# EAGLE design CircuitClockAutorouted (EAGLE 9.4.2)
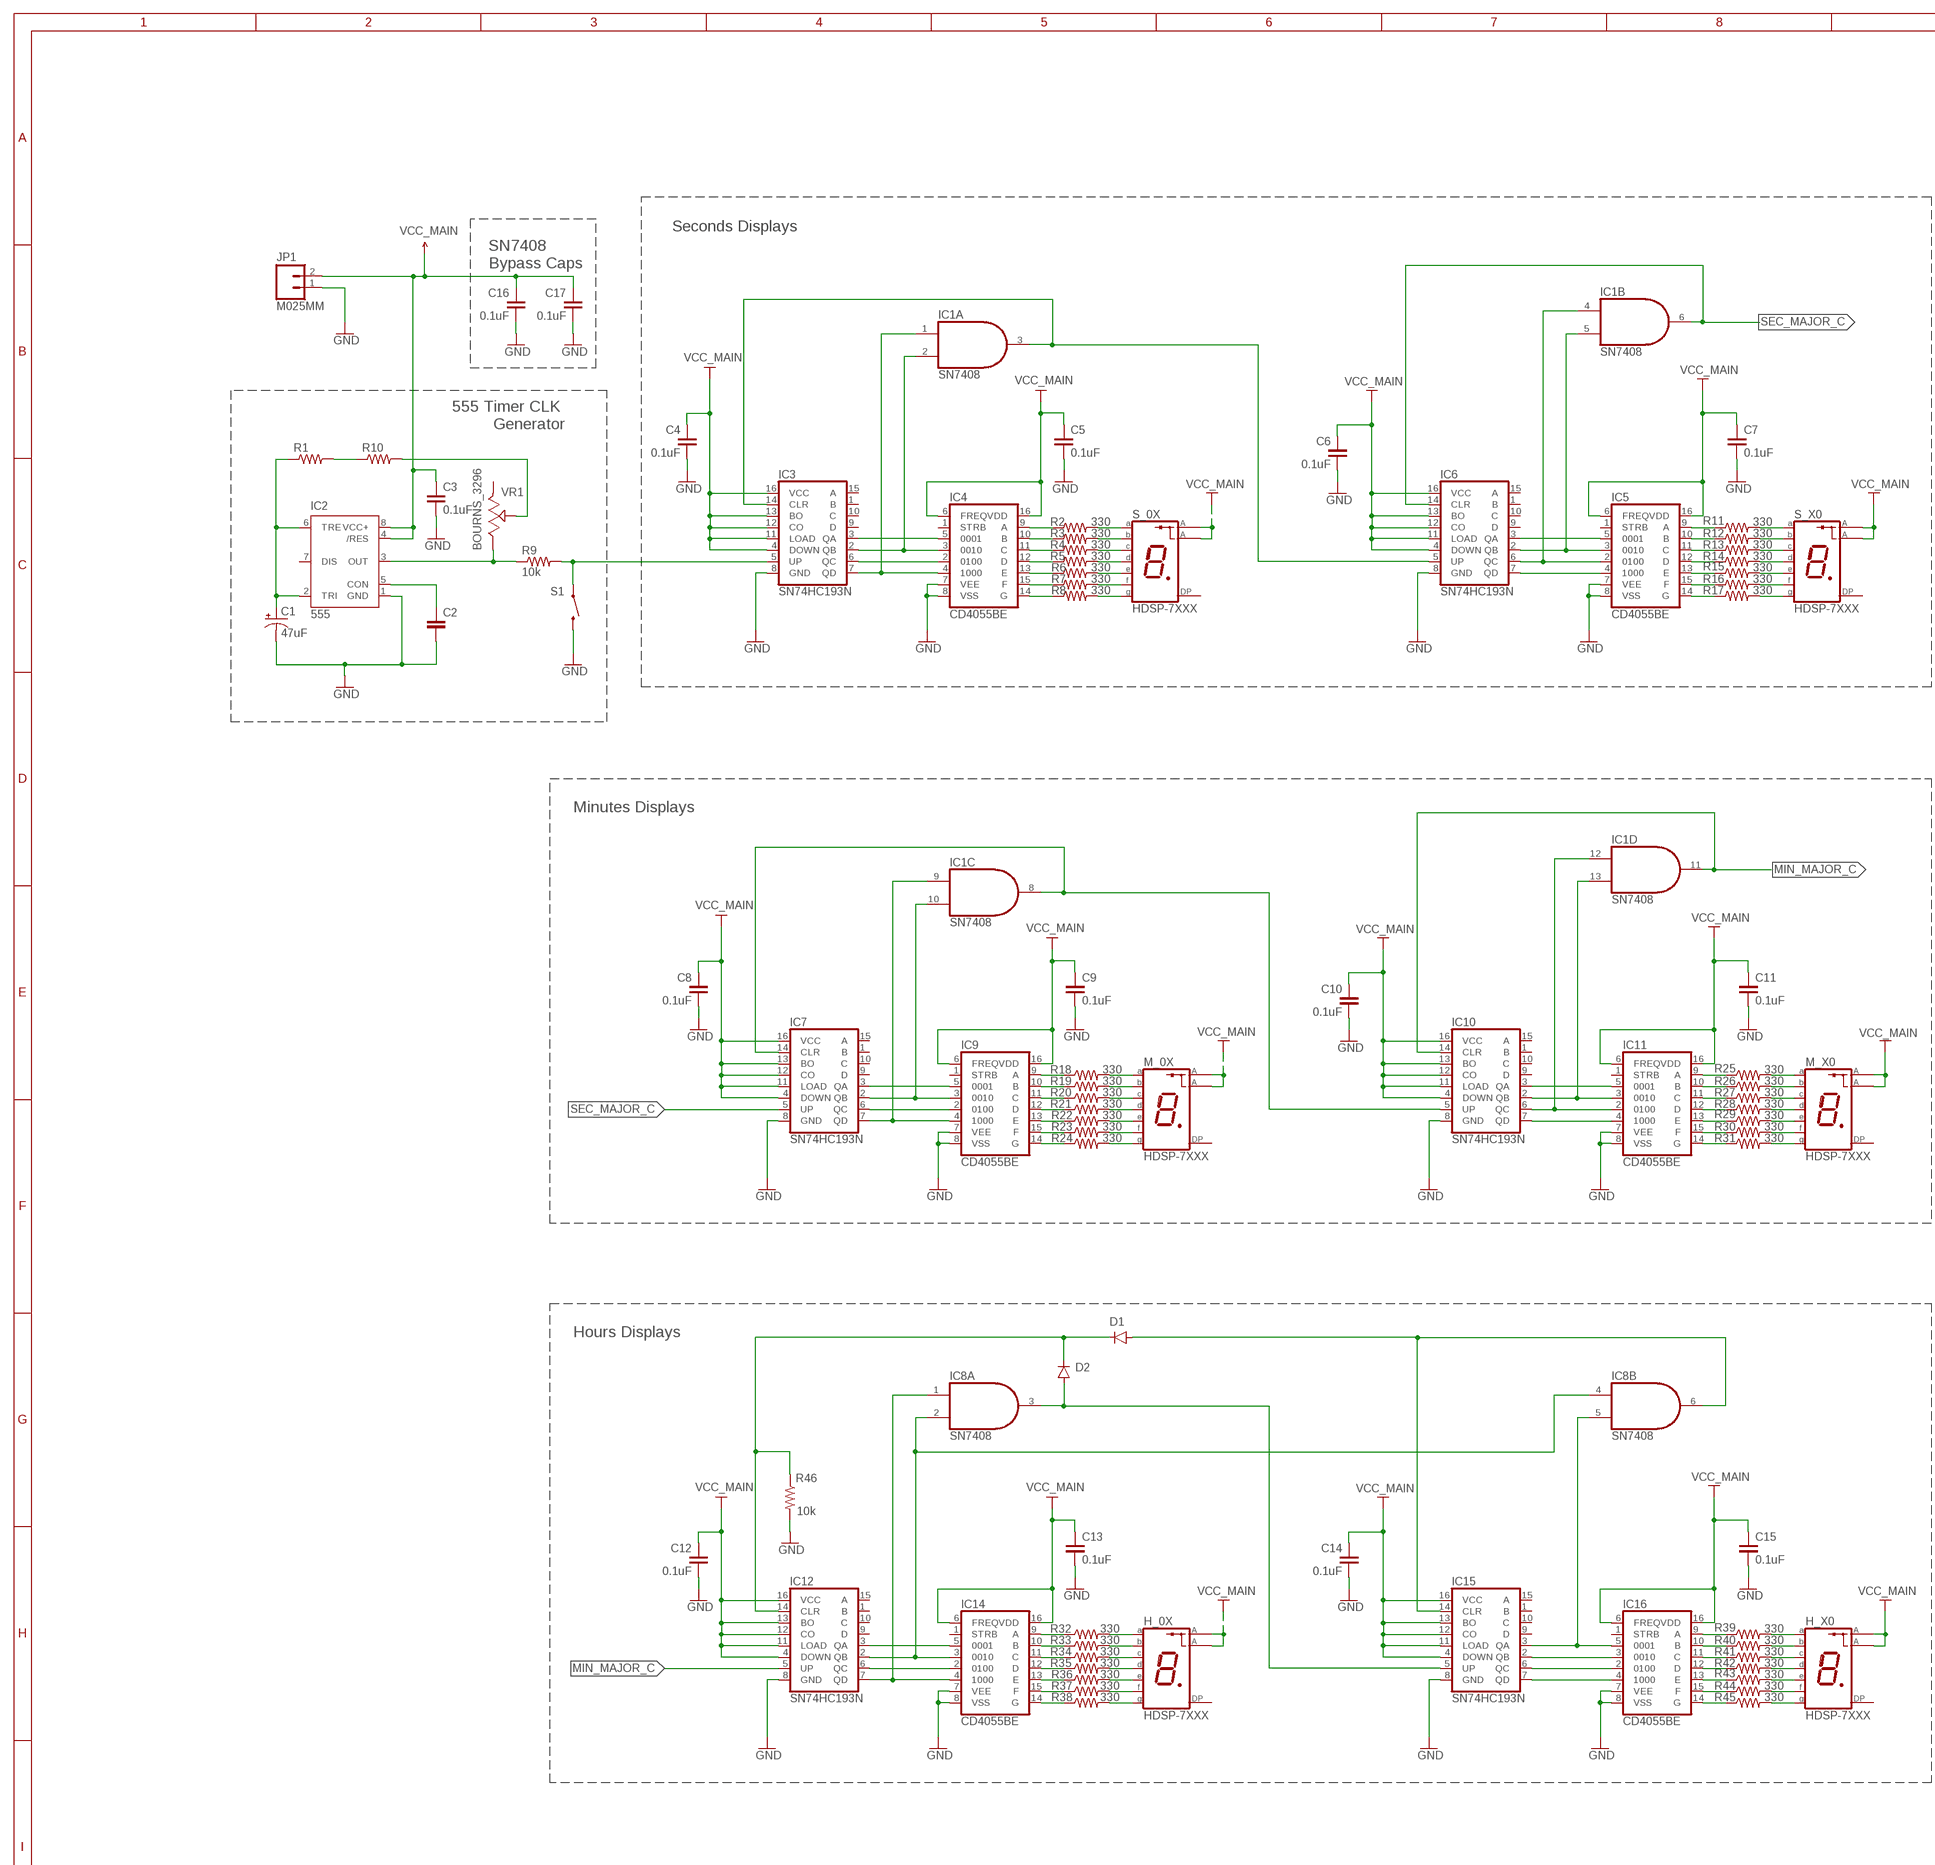
[diagram p0: schematic, sheet 1, part 1 of 2]
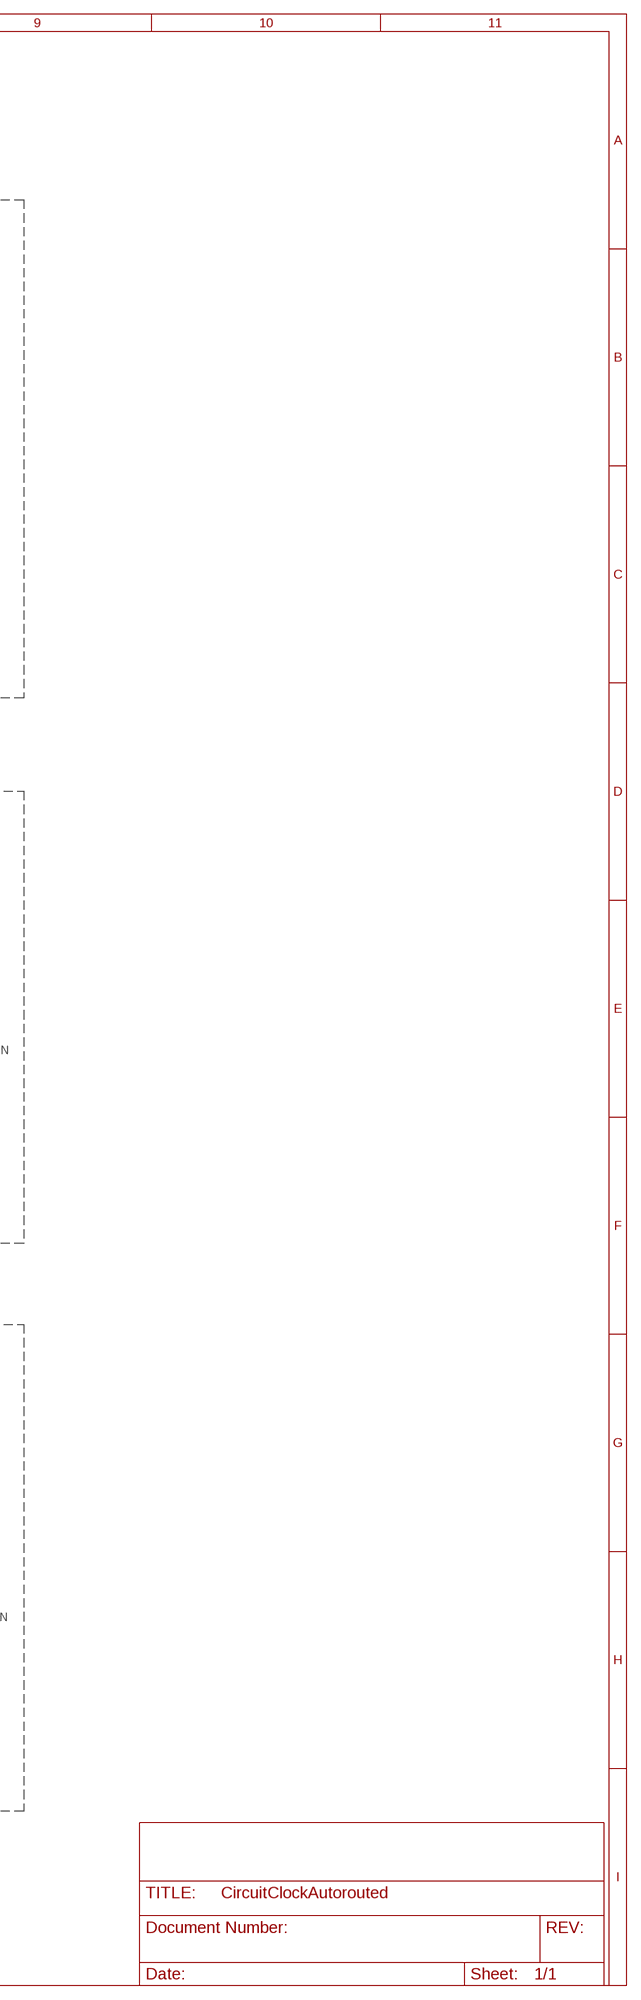
[diagram p1: schematic, sheet 1, part 2 of 2]

## Parts
C1  47uF  RADIAL_POL2.54MM_LEAD-6.3MM_DIA  [2.54MM_LEAD-6.3MM_DIA]
C2  CAPPTH  [CAP-PTH-SMALL]
C3  0.1uF  NON_POL_2.5MM  [2.54MM_LEAD]
C4  0.1uF  NON_POL_2.5MM  [2.54MM_LEAD]
C5  0.1uF  NON_POL_2.5MM  [2.54MM_LEAD]
C6  0.1uF  NON_POL_2.5MM  [2.54MM_LEAD]
C7  0.1uF  NON_POL_2.5MM  [2.54MM_LEAD]
C8  0.1uF  NON_POL_2.5MM  [2.54MM_LEAD]
C9  0.1uF  NON_POL_2.5MM  [2.54MM_LEAD]
C10  0.1uF  NON_POL_2.5MM  [2.54MM_LEAD]
C11  0.1uF  NON_POL_2.5MM  [2.54MM_LEAD]
C12  0.1uF  NON_POL_2.5MM  [2.54MM_LEAD]
C13  0.1uF  NON_POL_2.5MM  [2.54MM_LEAD]
C14  0.1uF  NON_POL_2.5MM  [2.54MM_LEAD]
C15  0.1uF  NON_POL_2.5MM  [2.54MM_LEAD]
C16  0.1uF  NON_POL_2.5MM  [2.54MM_LEAD]
C17  0.1uF  NON_POL_2.5MM  [2.54MM_LEAD]
D1  THROUGH_HOLE_DO-35  [DO35-10]
D2  THROUGH_HOLE_DO-35  [DO35-10]
H_0X  HDSP-7XXX  [HDSP-7XXX]
H_X0  HDSP-7XXX  [HDSP-7XXX]
IC1  SN7408  74S08N  [DIL14]
IC2  555  555KIT  [DIP08-KIT]
IC3  SN74HC193N  [DIL16]
IC4  CD4055BE  [DIL16]
IC5  CD4055BE  [DIL16]
IC6  SN74HC193N  [DIL16]
IC7  SN74HC193N  [DIL16]
IC8  SN7408  74S08N  [DIL14]
IC9  CD4055BE  [DIL16]
IC10  SN74HC193N  [DIL16]
IC11  CD4055BE  [DIL16]
IC12  SN74HC193N  [DIL16]
IC14  CD4055BE  [DIL16]
IC15  SN74HC193N  [DIL16]
IC16  CD4055BE  [DIL16]
JP1  M025MM  [SCREWTERMINAL-5MM-2]
M_0X  HDSP-7XXX  [HDSP-7XXX]
M_X0  HDSP-7XXX  [HDSP-7XXX]
R1  RESISTORAXIAL-0.3  [AXIAL-0.3]
R2  330  THROUGH_HOLE_1/4W_0.3  [1/4W_0.3]
R3  330  THROUGH_HOLE_1/4W_0.3  [1/4W_0.3]
R4  330  THROUGH_HOLE_1/4W_0.3  [1/4W_0.3]
R5  330  THROUGH_HOLE_1/4W_0.3  [1/4W_0.3]
R6  330  THROUGH_HOLE_1/4W_0.3  [1/4W_0.3]
R7  330  THROUGH_HOLE_1/4W_0.3  [1/4W_0.3]
R8  330  THROUGH_HOLE_1/4W_0.3  [1/4W_0.3]
R9  10k  RESISTORAXIAL-0.3  [AXIAL-0.3]
R10  RESISTORAXIAL-0.3  [AXIAL-0.3]
R11  330  THROUGH_HOLE_1/4W_0.3  [1/4W_0.3]
R12  330  THROUGH_HOLE_1/4W_0.3  [1/4W_0.3]
R13  330  THROUGH_HOLE_1/4W_0.3  [1/4W_0.3]
R14  330  THROUGH_HOLE_1/4W_0.3  [1/4W_0.3]
R15  330  THROUGH_HOLE_1/4W_0.3  [1/4W_0.3]
R16  330  THROUGH_HOLE_1/4W_0.3  [1/4W_0.3]
R17  330  THROUGH_HOLE_1/4W_0.3  [1/4W_0.3]
R18  330  THROUGH_HOLE_1/4W_0.3  [1/4W_0.3]
R19  330  THROUGH_HOLE_1/4W_0.3  [1/4W_0.3]
R20  330  THROUGH_HOLE_1/4W_0.3  [1/4W_0.3]
R21  330  THROUGH_HOLE_1/4W_0.3  [1/4W_0.3]
R22  330  THROUGH_HOLE_1/4W_0.3  [1/4W_0.3]
R23  330  THROUGH_HOLE_1/4W_0.3  [1/4W_0.3]
R24  330  THROUGH_HOLE_1/4W_0.3  [1/4W_0.3]
R25  330  THROUGH_HOLE_1/4W_0.3  [1/4W_0.3]
R26  330  THROUGH_HOLE_1/4W_0.3  [1/4W_0.3]
R27  330  THROUGH_HOLE_1/4W_0.3  [1/4W_0.3]
R28  330  THROUGH_HOLE_1/4W_0.3  [1/4W_0.3]
R29  330  THROUGH_HOLE_1/4W_0.3  [1/4W_0.3]
R30  330  THROUGH_HOLE_1/4W_0.3  [1/4W_0.3]
R31  330  THROUGH_HOLE_1/4W_0.3  [1/4W_0.3]
R32  330  THROUGH_HOLE_1/4W_0.3  [1/4W_0.3]
R33  330  THROUGH_HOLE_1/4W_0.3  [1/4W_0.3]
R34  330  THROUGH_HOLE_1/4W_0.3  [1/4W_0.3]
R35  330  THROUGH_HOLE_1/4W_0.3  [1/4W_0.3]
R36  330  THROUGH_HOLE_1/4W_0.3  [1/4W_0.3]
R37  330  THROUGH_HOLE_1/4W_0.3  [1/4W_0.3]
R38  330  THROUGH_HOLE_1/4W_0.3  [1/4W_0.3]
R39  330  THROUGH_HOLE_1/4W_0.3  [1/4W_0.3]
R40  330  THROUGH_HOLE_1/4W_0.3  [1/4W_0.3]
R41  330  THROUGH_HOLE_1/4W_0.3  [1/4W_0.3]
R42  330  THROUGH_HOLE_1/4W_0.3  [1/4W_0.3]
R43  330  THROUGH_HOLE_1/4W_0.3  [1/4W_0.3]
R44  330  THROUGH_HOLE_1/4W_0.3  [1/4W_0.3]
R45  330  THROUGH_HOLE_1/4W_0.3  [1/4W_0.3]
R46  10k  THROUGH_HOLE_1/4W_0.3  [1/4W_0.3]
S1  SWITCH-MOMENTARY-2PTH  [TACTILE-PTH]
S_0X  HDSP-7XXX  [HDSP-7XXX]
S_X0  HDSP-7XXX  [HDSP-7XXX]
VR1  BOURNS_3296  [3296]

## Nets
CLK: IC3.5(UP) R9.P$2 S1.1
GND: C1.- C2.2 C3.2 C4.2 C5.2 C6.2 C7.2 C8.2 C9.2 C10.2 C11.2 C12.2 C13.2 C14.2 C15.2 C16.2 C17.2 IC2.1(GND) IC3.8(GND) IC4.7(VEE) IC4.8(VSS) IC5.7(VEE) IC5.8(VSS) IC6.8(GND) IC7.8(GND) IC9.7(VEE) IC9.8(VSS) IC10.8(GND) IC11.7(VEE) IC11.8(VSS) IC12.8(GND) IC14.7(VEE) IC14.8(VSS) IC15.8(GND) IC16.7(VEE) IC16.8(VSS) JP1.1 R46.P$2 S1.3
HR_MAJOR_C: D1.C D2.C IC12.14(CLR) R46.P$1
HR_MINOR_C: D2.A IC8.3(A:O) IC15.5(UP)
MIN_MAJOR_C: IC1.11(D:O) IC10.14(CLR) IC12.5(UP)
MIN_MINOR_C: IC1.8(C:O) IC7.14(CLR) IC10.5(UP)
N$1: IC1.4(B:I0) IC5.2 IC6.6(QC)
N$2: C1.+ IC2.2(TRI) IC2.6(TRE) R1.P$1
N$3: IC3.3(QA) IC4.5
N$4: C2.1 IC2.5(CON)
N$5: IC1.2(A:I1) IC3.2(QB) IC4.3
N$6: IC1.5(B:I1) IC5.3 IC6.2(QB)
N$7: IC7.3(QA) IC9.5
N$8 [Power]: IC4.9(A) R2.P$1
N$9 [Power]: IC4.10(B) R3.P$1
N$10 [Power]: IC4.11(C) R4.P$1
N$11 [Power]: IC4.12(D) R5.P$1
N$12 [Power]: IC4.13(E) R6.P$1
N$13 [Power]: IC4.15(F) R7.P$1
N$14 [Power]: IC4.14(G) R8.P$1
N$15: IC2.3(OUT) R9.P$1 VR1.1(A)
N$16 [Power]: R2.P$2 S_0X.P$10(A)
N$17 [Power]: R3.P$2 S_0X.P$9(B)
N$18 [Power]: R4.P$2 S_0X.P$8(C)
N$19 [Power]: R5.P$2 S_0X.P$5(D)
N$20 [Power]: R6.P$2 S_0X.P$4(E)
N$21 [Power]: R7.P$2 S_0X.P$2(F)
N$22 [Power]: R8.P$2 S_0X.P$3(G)
N$23: R1.P$2 R10.P$1
N$24: R10.P$2 VR1.2(S)
N$25: IC1.1(A:I0) IC3.7(QD) IC4.4
N$26 [Power]: IC9.9(A) R18.P$1
N$27: IC5.4 IC6.7(QD)
N$28: IC5.5 IC6.3(QA)
N$29: IC3.6(QC) IC4.2
N$30 [Power]: IC5.9(A) R11.P$1
N$31 [Power]: IC5.10(B) R12.P$1
N$32 [Power]: IC5.11(C) R13.P$1
N$33 [Power]: IC5.12(D) R14.P$1
N$34 [Power]: IC5.13(E) R15.P$1
N$35 [Power]: IC5.15(F) R16.P$1
N$36 [Power]: IC5.14(G) R17.P$1
N$37 [Power]: R11.P$2 S_X0.P$10(A)
N$38 [Power]: R12.P$2 S_X0.P$9(B)
N$39 [Power]: R13.P$2 S_X0.P$8(C)
N$40 [Power]: R14.P$2 S_X0.P$5(D)
N$41 [Power]: R15.P$2 S_X0.P$4(E)
N$42 [Power]: R16.P$2 S_X0.P$2(F)
N$43 [Power]: R17.P$2 S_X0.P$3(G)
N$44 [Power]: IC9.10(B) R19.P$1
N$45 [Power]: IC9.11(C) R20.P$1
N$46 [Power]: IC9.12(D) R21.P$1
N$47 [Power]: IC9.13(E) R22.P$1
N$48 [Power]: IC9.15(F) R23.P$1
N$49 [Power]: IC9.14(G) R24.P$1
N$50 [Power]: M_0X.P$10(A) R18.P$2
N$51 [Power]: M_0X.P$9(B) R19.P$2
N$52 [Power]: M_0X.P$8(C) R20.P$2
N$53 [Power]: M_0X.P$5(D) R21.P$2
N$54 [Power]: M_0X.P$4(E) R22.P$2
N$55 [Power]: M_0X.P$2(F) R23.P$2
N$56 [Power]: M_0X.P$3(G) R24.P$2
N$57: IC10.3(QA) IC11.5
N$58 [Power]: IC11.9(A) R25.P$1
N$59 [Power]: IC11.10(B) R26.P$1
N$60 [Power]: IC11.11(C) R27.P$1
N$61 [Power]: IC11.12(D) R28.P$1
N$62 [Power]: IC11.13(E) R29.P$1
N$63 [Power]: IC11.15(F) R30.P$1
N$64 [Power]: IC11.14(G) R31.P$1
N$65 [Power]: M_X0.P$10(A) R25.P$2
N$66 [Power]: M_X0.P$9(B) R26.P$2
N$67 [Power]: M_X0.P$8(C) R27.P$2
N$68 [Power]: M_X0.P$5(D) R28.P$2
N$69 [Power]: M_X0.P$4(E) R29.P$2
N$70 [Power]: M_X0.P$2(F) R30.P$2
N$71 [Power]: M_X0.P$3(G) R31.P$2
N$72: IC10.7(QD) IC11.4
N$73: IC7.6(QC) IC9.2
N$74: IC1.12(D:I0) IC10.6(QC) IC11.2
N$75: IC1.13(D:I1) IC10.2(QB) IC11.3
N$76: IC1.9(C:I0) IC7.7(QD) IC9.4
N$77: IC1.10(C:I1) IC7.2(QB) IC9.3
N$80: IC12.3(QA) IC14.5
N$81 [Power]: IC14.9(A) R32.P$1
N$82 [Power]: IC14.10(B) R33.P$1
N$83 [Power]: IC14.11(C) R34.P$1
N$84 [Power]: IC14.12(D) R35.P$1
N$85 [Power]: IC14.13(E) R36.P$1
N$86 [Power]: IC14.15(F) R37.P$1
N$87 [Power]: IC14.14(G) R38.P$1
N$88 [Power]: H_0X.P$10(A) R32.P$2
N$89 [Power]: H_0X.P$9(B) R33.P$2
N$90 [Power]: H_0X.P$8(C) R34.P$2
N$91 [Power]: H_0X.P$5(D) R35.P$2
N$92 [Power]: H_0X.P$4(E) R36.P$2
N$93 [Power]: H_0X.P$2(F) R37.P$2
N$94 [Power]: H_0X.P$3(G) R38.P$2
N$96 [Power]: IC16.9(A) R39.P$1
N$97 [Power]: IC16.10(B) R40.P$1
N$98 [Power]: IC16.11(C) R41.P$1
N$99 [Power]: IC16.12(D) R42.P$1
N$100 [Power]: IC16.13(E) R43.P$1
N$101 [Power]: IC16.15(F) R44.P$1
N$102 [Power]: IC16.14(G) R45.P$1
N$103 [Power]: H_X0.P$10(A) R39.P$2
N$104 [Power]: H_X0.P$9(B) R40.P$2
N$105 [Power]: H_X0.P$8(C) R41.P$2
N$106 [Power]: H_X0.P$5(D) R42.P$2
N$107 [Power]: H_X0.P$4(E) R43.P$2
N$108 [Power]: H_X0.P$2(F) R44.P$2
N$109 [Power]: H_X0.P$3(G) R45.P$2
N$110: IC15.7(QD) IC16.4
N$111: IC12.6(QC) IC14.2
N$112: IC15.6(QC) IC16.2
N$113: IC15.2(QB) IC16.3
N$114: IC8.1(A:I0) IC12.7(QD) IC14.4
N$115: IC8.2(A:I1) IC8.4(B:I0) IC12.2(QB) IC14.3
N$117: D1.A IC8.6(B:O) IC15.14(CLR)
N$118: IC8.5(B:I1) IC15.3(QA) IC16.5
SEC_MAJOR_C: IC1.6(B:O) IC6.14(CLR) IC7.5(UP)
SEC_MINOR_C: IC1.3(A:O) IC3.14(CLR) IC6.5(UP)
VCC_MAIN [Power]: C3.1 C4.1 C5.1 C6.1 C7.1 C8.1 C9.1 C10.1 C11.1 C12.1 C13.1 C14.1 C15.1 C16.1 C17.1 H_0X.P$1(A) H_0X.P$6(A) H_X0.P$1(A) H_X0.P$6(A) IC2.4(/RES) IC2.8(VCC+) IC3.4(DOWN) IC3.11(LOAD) IC3.12(CO) IC3.13(BO) IC3.16(VCC) IC4.6(FREQ) IC4.16(VDD) IC5.6(FREQ) IC5.16(VDD) IC6.4(DOWN) IC6.11(LOAD) IC6.12(CO) IC6.13(BO) IC6.16(VCC) IC7.4(DOWN) IC7.11(LOAD) IC7.12(CO) IC7.13(BO) IC7.16(VCC) IC9.6(FREQ) IC9.16(VDD) IC10.4(DOWN) IC10.11(LOAD) IC10.12(CO) IC10.13(BO) IC10.16(VCC) IC11.6(FREQ) IC11.16(VDD) IC12.4(DOWN) IC12.11(LOAD) IC12.12(CO) IC12.13(BO) IC12.16(VCC) IC14.6(FREQ) IC14.16(VDD) IC15.4(DOWN) IC15.11(LOAD) IC15.12(CO) IC15.13(BO) IC15.16(VCC) IC16.6(FREQ) IC16.16(VDD) JP1.2 M_0X.P$1(A) M_0X.P$6(A) M_X0.P$1(A) M_X0.P$6(A) S_0X.P$1(A) S_0X.P$6(A) S_X0.P$1(A) S_X0.P$6(A) ; supply symbol labelled SINK_UNDEFINED, SUPPLY_UNDEFINED
Unconnected: H_0X.P$7(DP) H_X0.P$7(DP) IC2.7(DIS) IC3.1(B) IC3.9(D) IC3.10(C) IC3.15(A) IC4.1(STRB) IC5.1(STRB) IC6.1(B) IC6.9(D) IC6.10(C) IC6.15(A) IC7.1(B) IC7.9(D) IC7.10(C) IC7.15(A) IC8.8(C:O) IC8.9(C:I0) IC8.10(C:I1) IC8.11(D:O) IC8.12(D:I0) IC8.13(D:I1) IC9.1(STRB) IC10.1(B) IC10.9(D) IC10.10(C) IC10.15(A) IC11.1(STRB) IC12.1(B) IC12.9(D) IC12.10(C) IC12.15(A) IC14.1(STRB) IC15.1(B) IC15.9(D) IC15.10(C) IC15.15(A) IC16.1(STRB) M_0X.P$7(DP) M_X0.P$7(DP) S_0X.P$7(DP) S_X0.P$7(DP) VR1.3(E)

## Notes on the sheet
- Seconds Displays
- SN7408
  Bypass Caps
- 555 Timer CLK 
  Generator
- Minutes Displays
- Hours Displays

## Power pins joined to a net without a drawn wire
GND: IC1.7(P:GND) IC8.7(P:GND)
VCC: IC1.14(P:VCC) IC8.14(P:VCC)

## Library data of the parts
C1 = Capacitors:RADIAL_POL
C2 = SparkFun-Capacitors:CAP: Capacitor Standard 0603 ceramic capacitor, and 0.1" leaded capacitor.
C3-C17 = Capacitors:NON_POL
D1 D2 = Diodes:THROUGH_HOLE: DIODE silicon-epitaxial planar diode
H_0X H_X0 M_0X M_X0 S_0X S_X0 = led-7-segment:HDSP-7XXX
IC1 IC8 = 74xx-us:74*08: Quad 2-input AND gate
IC2 = SparkFun-IC-Special-Function:555: General purpose bipolar Timer Datasheet <http://www.sparkfun.com/datasheets/Components/General/ne555.pdf> SparkFun Products SparkFun SparkPunk Sequencer Kit <https://www.sparkfun.com/products/12707> (KIT-12707) Storefront Component: 555 Timer <https://www.sparkfun.com/products/9273> (COM-09273) Two parts valid for production: VFP: IC-11930 (M7555 PTH) VFP: IC-09173 (555 PTH) - Preferred; PROD_ID: IC-09173; PROD_ID_ALT: IC-11930
IC3 IC6 IC7 IC10 IC12 IC15 = ICs:SN74HC193N
IC4 IC5 IC9 IC11 IC14 IC16 = ICs:CD4055BE
JP1 = SparkFun-Connectors:M02: Standard 2-pin 0.1" header. Use with - straight break away headers ( PRT-00116) - right angle break away headers (PRT-00553) - swiss pins (PRT-00743) - machine pins (PRT-00117) - female headers (PRT-00115) Molex polarized connector foot print use with: PRT-08233 with associated crimp pins and housings. 2.54_SCREWTERM for use with PRT-10571. 3.5mm Screw Terminal footprints for PRT-08084 5mm Screw Terminal footprints for use with PRT-08432; STOREFRONT_ID: PRT-08432
R1 R9 R10 = SparkFun-Passives:RESISTOR: Resistor Basic schematic elements and footprints for 0603, 1206, and PTH resistors.
R2-R8 R11-R46 = Resistors:THROUGH_HOLE
S1 = SparkFun-Electromechanical:SWITCH-MOMENTARY-2: Various NO switches- pushbuttons, reed, etc
VR1 = Offboard Potentiometer:BOURNS_3296

## Net classes
0 default: width 0.254 mm
1 Power: width 0.305 mm, clearance 0.305 mm to class 0

## Board
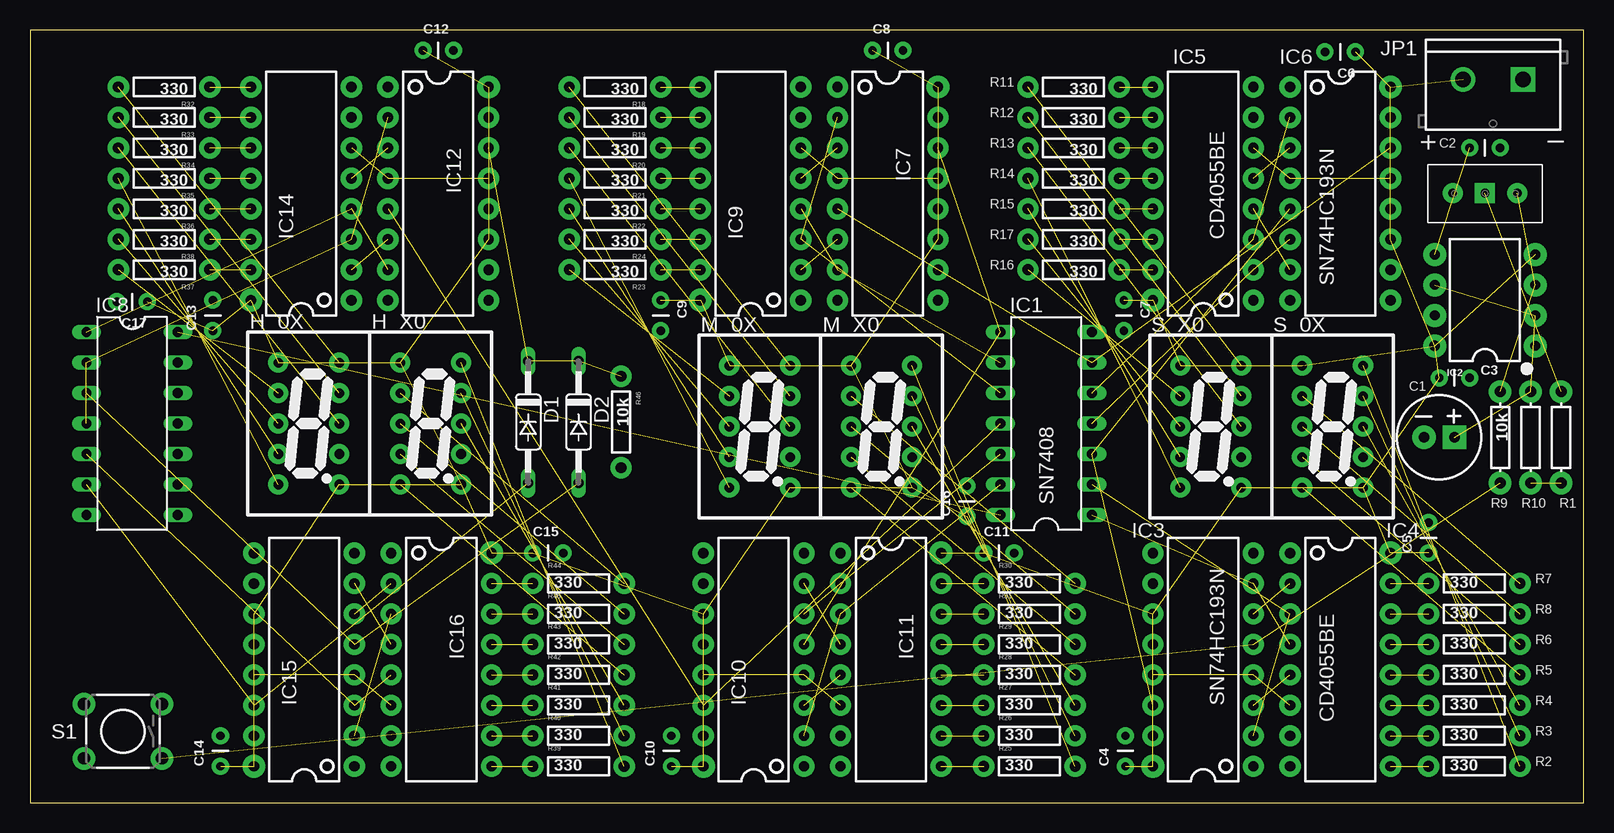
[diagram p2: board, top side]
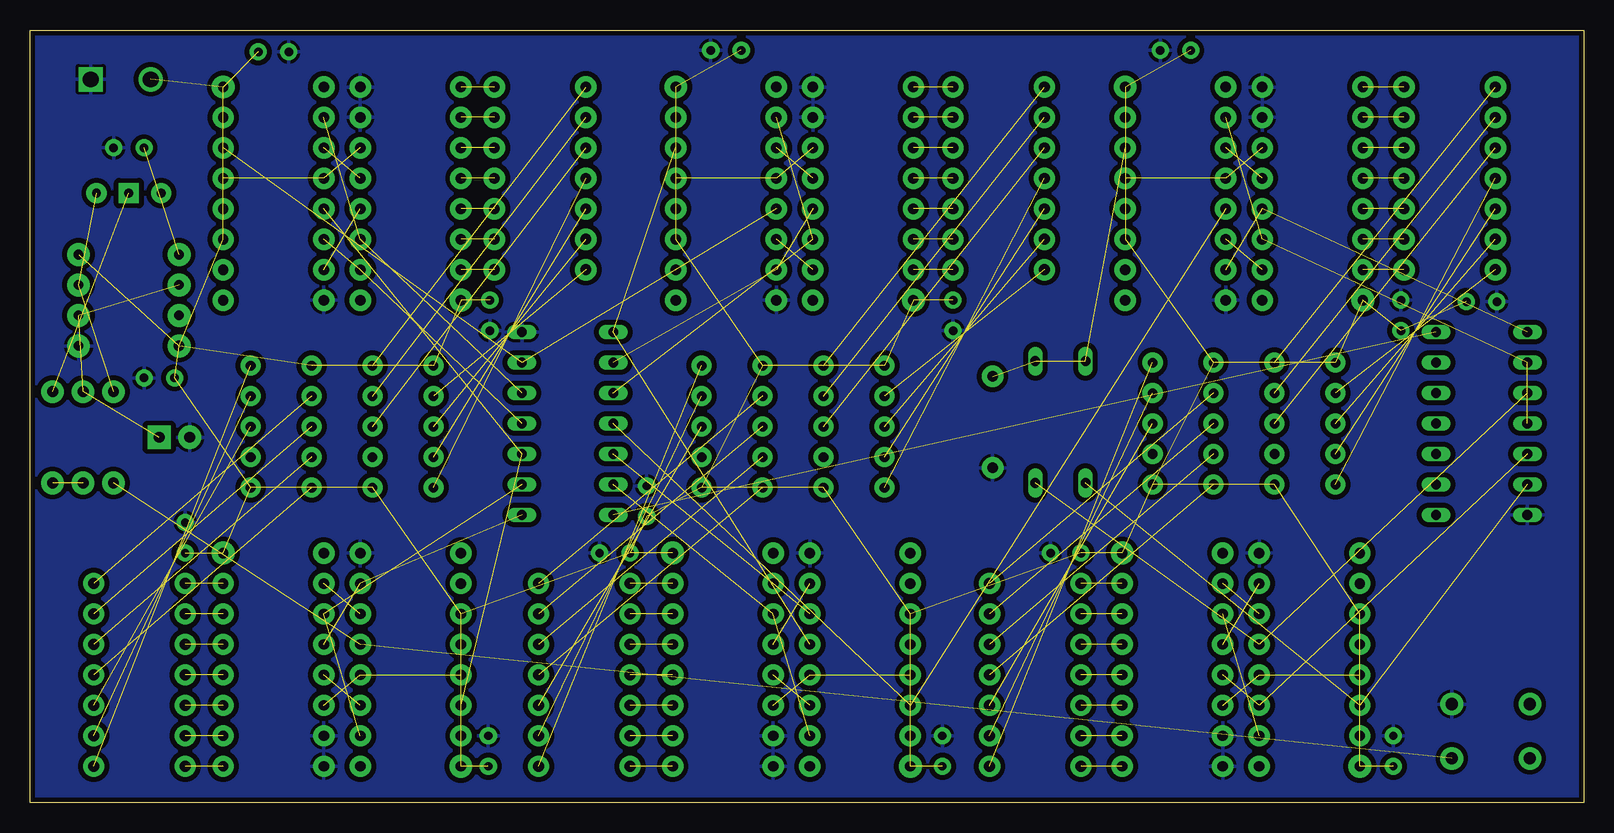
[diagram p3: board, bottom side, seen from below]

Size 129.52 x 64.44 mm. Coordinates in mm from the lower left corner, seen from the top.
Outline: 0,0 129.52,0 129.52,64.44 0,64.44 0,0
Copper layers (1*16): Top 0.035559375mm / dielectric 1.6mm / Bottom 0.035559375mm
Design rules "OshPark-2layer *": minimum track width 6mil, minimum drill 10mil, track to track 8mil, track to pad 8mil, pad to pad 8mil, via to via 8mil, smd to smd 6mil, copper to edge 15mil, drill to drill 6mil, minimum pad ring 5mil, minimum via ring 5mil, stop-mask expansion 2.5mil, vias tented up to drill 0mil, thermal gap 10mil

### Footprints (pad centres in the part's own frame; a part is rotated, then mirrored left to right if it is on the bottom)
2.54MM_LEAD-6.3MM_DIA = drill 0.9 pad 1.93 square: + 1.27,0 | drill 0.9 pad 1.93: - -1.27,0
CAP-PTH-SMALL = drill 0.7 pad 1.422: 1 0,0; 2 2.54,0
2.54MM_LEAD = drill 0.7 pad 1.422: 1 -1.27,0; 2 1.27,0
DO35-10 = drill 0.813 long: A 5.08,0; C -5.08,0
HDSP-7XXX = drill 0.8 pad 1.676: P$1 -2.54,5.08; P$2 -2.54,2.54; P$3 -2.54,0; P$4 -2.54,-2.54; P$5 -2.54,-5.08; P$6 2.54,-5.08; P$7 2.54,-2.54; P$8 2.54,0; P$9 2.54,2.54; P$10 2.54,5.08
DIL14 = drill 0.813 long: 1 -7.62,-3.81; 2 -5.08,-3.81; 3 -2.54,-3.81; 4 0,-3.81; 5 2.54,-3.81; 6 5.08,-3.81; 7 7.62,-3.81; 8 7.62,3.81; 9 5.08,3.81; 10 2.54,3.81; 11 0,3.81; 12 -2.54,3.81; 13 -5.08,3.81; 14 -7.62,3.81
DIP08-KIT = drill 0.813 pad 1.905: 1 -3.81,-4.191; 2 -1.27,-4.191; 3 1.27,-4.191; 4 3.81,-4.191; 5 3.81,4.191; 6 1.27,4.191; 7 -1.27,4.191 | drill 0.864 pad 1.905: 8 -3.81,4.191
DIL16 = drill 0.864 pad 1.778: 1 -8.89,-4.191; 2 -6.35,-4.191; 3 -3.81,-4.191; 4 -1.27,-4.191; 5 1.27,-4.191; 6 3.81,-4.191; 7 6.35,-4.191; 8 8.89,-4.191; 9 8.89,4.191; 10 6.35,4.191; 11 3.81,4.191; 12 1.27,4.191; 13 -1.27,4.191; 14 -3.81,4.191; 15 -6.35,4.191 | drill 0.864 pad 1.905: 16 -8.89,4.191
SCREWTERMINAL-5MM-2 = drill 1.3 pad 2.032 square: 1 0,0 | drill 1.3 pad 2.032: 2 5,0
AXIAL-0.3 = drill 0.9 pad 1.88: P$1 -3.81,0; P$2 3.81,0
1/4W_0.3 = drill 0.9 pad 1.778: P$1 -3.81,0; P$2 3.81,0
TACTILE-PTH = drill 1.016 pad 1.88: 1 -3.251,2.261; 2 3.251,2.261; 3 -3.251,-2.261; 4 3.251,-2.261
3296 = drill 0.737 pad 1.676: 1 -2.692,-0.035; 3 2.692,-0.035 | drill 0.737 pad 1.676 square: 2 0,-0.035

### Placement (x,y rotation side)
C1  117.47,30.48 0 top
C2  120.02,54.61 0 top
C3  118.75,35.43 0 top
C4  91.31,4.32 90 top
C5  116.59,22.1 90 top
C6  109.22,62.61 180 top
C7  91.19,40.64 270 top
C8  71.5,62.74 0 top
C9  52.58,40.64 270 top
C10  53.47,4.32 90 top
C11  80.77,20.83 0 top
C12  34.04,62.74 0 top
C13  15.24,40.64 90 top
C14  15.88,4.32 90 top
C15  43.18,20.83 0 top
C16  78.11,25.15 90 top
C17  8.51,41.78 180 top
D1  41.53,31.75 270 top
D2  45.72,31.75 270 top
H_0X  23.24,31.62 0 top
H_X0  33.4,31.62 0 top
IC1  84.71,31.62 90 top
IC2  121.28,41.91 90 top
IC3  97.79,11.94 90 top
IC4  109.22,11.94 270 top
IC5  97.79,50.8 90 top
IC6  109.22,50.8 270 top
IC7  71.5,50.8 270 top
IC8  8.51,31.62 270 top
IC9  60.07,50.8 90 top
IC10  60.33,11.94 90 top
IC11  71.75,11.94 270 top
IC12  34.04,50.8 270 top
IC14  22.61,50.8 90 top
IC15  22.86,11.94 90 top
IC16  34.29,11.94 270 top
JP1  124.46,60.33 180 top
M_0X  60.83,31.37 0 top
M_X0  70.99,31.37 0 top
R1  125.09,30.48 270 top
R2  120.4,3.05 0 top
R3  120.4,5.59 0 top
R4  120.4,8.13 0 top
R5  120.4,10.67 0 top
R6  120.4,13.21 0 top
R7  120.4,18.29 0 top
R8  120.4,15.75 0 top
R9  122.56,30.48 270 top
R10  127.64,30.48 90 top
R11  87,59.69 180 top
R12  87,57.15 180 top
R13  87,54.61 180 top
R14  87,52.07 180 top
R15  87,49.53 180 top
R16  87,44.45 180 top
R17  87,46.99 180 top
R18  48.77,59.69 180 top
R19  48.77,57.15 180 top
R20  48.77,54.61 180 top
R21  48.77,52.07 180 top
R22  48.77,49.53 180 top
R23  48.77,44.45 180 top
R24  48.77,46.99 180 top
R25  83.31,3.05 0 top
R26  83.31,5.59 0 top
R27  83.31,8.13 0 top
R28  83.31,10.67 0 top
R29  83.31,13.21 0 top
R30  83.31,18.29 0 top
R31  83.31,15.75 0 top
R32  11.18,59.69 180 top
R33  11.18,57.15 180 top
R34  11.18,54.61 180 top
R35  11.18,52.07 180 top
R36  11.18,49.53 180 top
R37  11.18,44.45 180 top
R38  11.18,46.99 180 top
R39  45.72,3.05 0 top
R40  45.72,5.59 0 top
R41  45.72,8.13 0 top
R42  45.72,10.67 0 top
R43  45.72,13.21 0 top
R44  45.72,18.29 0 top
R45  45.72,15.75 0 top
R46  49.28,31.75 270 top
S1  7.75,5.97 180 top
S_0X  108.58,31.37 0 top
S_X0  98.42,31.37 0 top
VR1  121.28,50.8 180 top

### Tracks (layer width: path | path; a pad name or v marks a point on that pad's centre or on a via)
CLK  (2 unrouted)
GND
  pour Bottom (isolate 0.406): 0,0 0,64.14 129.54,64.14 129.54,0
HR_MAJOR_C  (3 unrouted)
HR_MINOR_C  (2 unrouted)
MIN_MAJOR_C  (2 unrouted)
MIN_MINOR_C  (2 unrouted)
N$1  (2 unrouted)
N$2  (3 unrouted)
N$3  (1 unrouted)
N$4  (1 unrouted)
N$5  (2 unrouted)
N$6  (2 unrouted)
N$7  (1 unrouted)
N$8  (1 unrouted)
N$9  (1 unrouted)
N$10  (1 unrouted)
N$11  (1 unrouted)
N$12  (1 unrouted)
N$13  (1 unrouted)
N$14  (1 unrouted)
N$15  (2 unrouted)
N$16  (1 unrouted)
N$17  (1 unrouted)
N$18  (1 unrouted)
N$19  (1 unrouted)
N$20  (1 unrouted)
N$21  (1 unrouted)
N$22  (1 unrouted)
N$23  (1 unrouted)
N$24  (1 unrouted)
N$25  (2 unrouted)
N$26  (1 unrouted)
N$27  (1 unrouted)
N$28  (1 unrouted)
N$29  (1 unrouted)
N$30  (1 unrouted)
N$31  (1 unrouted)
N$32  (1 unrouted)
N$33  (1 unrouted)
N$34  (1 unrouted)
N$35  (1 unrouted)
N$36  (1 unrouted)
N$37  (1 unrouted)
N$38  (1 unrouted)
N$39  (1 unrouted)
N$40  (1 unrouted)
N$41  (1 unrouted)
N$42  (1 unrouted)
N$43  (1 unrouted)
N$44  (1 unrouted)
N$45  (1 unrouted)
N$46  (1 unrouted)
N$47  (1 unrouted)
N$48  (1 unrouted)
N$49  (1 unrouted)
N$50  (1 unrouted)
N$51  (1 unrouted)
N$52  (1 unrouted)
N$53  (1 unrouted)
N$54  (1 unrouted)
N$55  (1 unrouted)
N$56  (1 unrouted)
N$57  (1 unrouted)
N$58  (1 unrouted)
N$59  (1 unrouted)
N$60  (1 unrouted)
N$61  (1 unrouted)
N$62  (1 unrouted)
N$63  (1 unrouted)
N$64  (1 unrouted)
N$65  (1 unrouted)
N$66  (1 unrouted)
N$67  (1 unrouted)
N$68  (1 unrouted)
N$69  (1 unrouted)
N$70  (1 unrouted)
N$71  (1 unrouted)
N$72  (1 unrouted)
N$73  (1 unrouted)
N$74  (2 unrouted)
N$75  (2 unrouted)
N$76  (2 unrouted)
N$77  (2 unrouted)
N$80  (1 unrouted)
N$81  (1 unrouted)
N$82  (1 unrouted)
N$83  (1 unrouted)
N$84  (1 unrouted)
N$85  (1 unrouted)
N$86  (1 unrouted)
N$87  (1 unrouted)
N$88  (1 unrouted)
N$89  (1 unrouted)
N$90  (1 unrouted)
N$91  (1 unrouted)
N$92  (1 unrouted)
N$93  (1 unrouted)
N$94  (1 unrouted)
N$96  (1 unrouted)
N$97  (1 unrouted)
N$98  (1 unrouted)
N$99  (1 unrouted)
N$100  (1 unrouted)
N$101  (1 unrouted)
N$102  (1 unrouted)
N$103  (1 unrouted)
N$104  (1 unrouted)
N$105  (1 unrouted)
N$106  (1 unrouted)
N$107  (1 unrouted)
N$108  (1 unrouted)
N$109  (1 unrouted)
N$110  (1 unrouted)
N$111  (1 unrouted)
N$112  (1 unrouted)
N$113  (1 unrouted)
N$114  (2 unrouted)
N$115  (3 unrouted)
N$117  (2 unrouted)
N$118  (2 unrouted)
SEC_MAJOR_C  (2 unrouted)
SEC_MINOR_C  (2 unrouted)
VCC  (1 unrouted)
VCC_MAIN  (71 unrouted)

### Text on the board
tPlace: Derek Nash / Isaac Rex | + | –